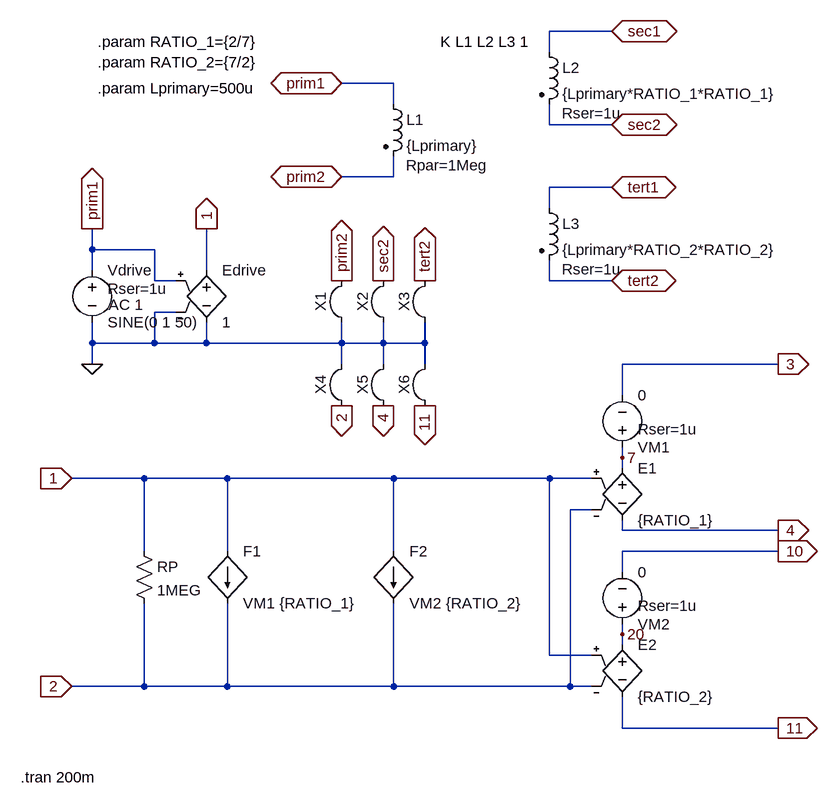
[diagram p0: schematic Transformers.asc]
Transformers.asc, the LTspice schematic file:
Version 4
SHEET 1 880 704
WIRE 384 -544 288 -544
WIRE 288 -512 288 -544
WIRE 48 -464 -32 -464
WIRE 48 -432 48 -464
WIRE 288 -400 288 -432
WIRE 384 -400 288 -400
WIRE 48 -320 48 -352
WIRE 48 -320 -32 -320
WIRE 384 -304 288 -304
WIRE 288 -272 288 -304
WIRE -416 -208 -416 -240
WIRE -320 -208 -416 -208
WIRE -416 -176 -416 -208
WIRE -240 -176 -240 -240
WIRE -320 -160 -320 -208
WIRE -288 -160 -320 -160
WIRE 288 -160 288 -192
WIRE 384 -160 288 -160
WIRE -288 -112 -320 -112
WIRE -416 -64 -416 -96
WIRE -320 -64 -320 -112
WIRE -320 -64 -416 -64
WIRE -240 -64 -240 -96
WIRE -240 -64 -320 -64
WIRE -32 -64 -32 -96
WIRE -32 -64 -240 -64
WIRE 32 -64 32 -96
WIRE 32 -64 -32 -64
WIRE 96 -64 96 -96
WIRE 96 -64 32 -64
WIRE -416 -32 -416 -64
WIRE -32 -32 -32 -64
WIRE 32 -32 32 -64
WIRE 96 -32 96 -64
WIRE 640 -32 400 -32
WIRE 400 16 400 -32
WIRE 400 112 400 96
WIRE 400 128 400 112
WIRE -336 144 -448 144
WIRE -208 144 -336 144
WIRE 48 144 -208 144
WIRE 288 144 48 144
WIRE 352 144 288 144
WIRE 352 192 320 192
WIRE 400 224 400 208
WIRE 640 224 400 224
WIRE -336 256 -336 144
WIRE -208 256 -208 144
WIRE 48 256 48 144
WIRE 640 256 400 256
WIRE 400 288 400 256
WIRE 400 384 400 368
WIRE 400 400 400 384
WIRE 288 416 288 144
WIRE 352 416 288 416
WIRE -336 464 -336 336
WIRE -336 464 -448 464
WIRE -208 464 -208 336
WIRE -208 464 -336 464
WIRE 48 464 48 336
WIRE 48 464 -208 464
WIRE 320 464 320 192
WIRE 320 464 48 464
WIRE 352 464 320 464
WIRE 400 528 400 480
WIRE 640 528 400 528
FLAG -448 144 1
IOPIN -448 144 In
FLAG -448 464 2
IOPIN -448 464 In
FLAG 400 112 7
FLAG 640 -32 3
IOPIN 640 -32 Out
FLAG 640 224 4
IOPIN 640 224 Out
FLAG 640 528 11
IOPIN 640 528 Out
FLAG 400 384 20
FLAG 640 256 10
IOPIN 640 256 Out
FLAG -32 -464 prim1
IOPIN -32 -464 BiDir
FLAG -32 -320 prim2
IOPIN -32 -320 BiDir
FLAG 384 -544 sec1
IOPIN 384 -544 BiDir
FLAG 384 -400 sec2
IOPIN 384 -400 BiDir
FLAG 384 -304 tert1
IOPIN 384 -304 BiDir
FLAG 384 -160 tert2
IOPIN 384 -160 BiDir
FLAG -416 -32 0
FLAG -416 -240 prim1
IOPIN -416 -240 Out
FLAG -240 -240 1
IOPIN -240 -240 Out
FLAG -32 -160 prim2
IOPIN -32 -160 Out
FLAG 32 -160 sec2
IOPIN 32 -160 Out
FLAG 96 -160 tert2
IOPIN 96 -160 Out
FLAG -32 32 2
IOPIN -32 32 Out
FLAG 32 32 4
IOPIN 32 32 Out
FLAG 96 32 11
IOPIN 96 32 Out
SYMBOL res -352 240 R0
SYMATTR InstName RP
SYMATTR Value 1MEG
SYMBOL e 400 112 R0
SYMATTR InstName E1
SYMATTR Value {RATIO_1}
SYMBOL f -208 256 R0
SYMATTR InstName F1
SYMATTR Value VM1 {RATIO_1}
SYMBOL e 400 384 R0
SYMATTR InstName E2
SYMATTR Value {RATIO_2}
SYMBOL f 48 256 R0
SYMATTR InstName F2
SYMATTR Value VM2 {RATIO_2}
SYMBOL voltage 400 112 M180
WINDOW 123 0 0 Left 0
WINDOW 39 24 44 Left 0
SYMATTR InstName VM1
SYMATTR Value 0
SYMATTR SpiceLine Rser=1u
SYMBOL voltage 400 384 M180
WINDOW 123 0 0 Left 0
WINDOW 39 24 44 Left 0
SYMATTR InstName VM2
SYMATTR Value 0
SYMATTR SpiceLine Rser=1u
SYMBOL ind2 32 -448 R0
WINDOW 39 35 110 Left 0
SYMATTR InstName L1
SYMATTR Value {Lprimary}
SYMATTR Type ind
SYMATTR SpiceLine Rpar=1Meg
SYMBOL ind2 272 -528 R0
WINDOW 39 35 110 Left 0
SYMATTR InstName L2
SYMATTR Value {Lprimary*RATIO_1*RATIO_1}
SYMATTR Type ind
SYMATTR SpiceLine Rser=1u
SYMBOL ind2 272 -288 R0
WINDOW 39 35 110 Left 0
SYMATTR InstName L3
SYMATTR Value {Lprimary*RATIO_2*RATIO_2}
SYMATTR Type ind
SYMATTR SpiceLine Rser=1u
SYMBOL voltage -416 -192 R0
WINDOW 123 25 69 Left 0
WINDOW 39 24 44 Left 0
SYMATTR InstName Vdrive
SYMATTR Value SINE(0 1 50)
SYMATTR Value2 AC 1
SYMATTR SpiceLine Rser=1u
SYMBOL e -240 -192 R0
SYMATTR InstName Edrive
SYMATTR Value 1
SYMBOL Misc\\jumper -96 -128 M90
SYMATTR InstName X1
SYMBOL Misc\\jumper -32 -128 M90
SYMATTR InstName X2
SYMBOL Misc\\jumper 32 -128 M90
SYMATTR InstName X3
SYMBOL Misc\\jumper -96 0 M90
SYMATTR InstName X4
SYMBOL Misc\\jumper -32 0 M90
SYMATTR InstName X5
SYMBOL Misc\\jumper 32 0 M90
SYMATTR InstName X6
TEXT 120 -528 Left 0 !K L1 L2 L3 1
TEXT -408 -528 Left 0 !.param RATIO_1={2/7}
TEXT -408 -496 Left 0 !.param RATIO_2={7/2}
TEXT -526 604 Left 0 !.tran 200m
TEXT -408 -456 Left 0 !.param Lprimary=500u

The netlist it stands for:
* Transformers.asc
RP 1 0 1MEG
E1 7 0 1 0 {RATIO_1}
F1 1 0 VM1 {RATIO_1}
E2 20 0 1 0 {RATIO_2}
F2 1 0 VM2 {RATIO_2}
VM1 7 3 0 Rser=1u
VM2 20 10 0 Rser=1u
L1 prim1 0 {Lprimary} Rpar=1Meg
L2 sec1 0 {Lprimary*RATIO_1*RATIO_1} Rser=1u
L3 tert1 0 {Lprimary*RATIO_2*RATIO_2} Rser=1u
Vdrive prim1 0 SINE(0 1 50) AC 1 Rser=1u
Edrive 1 0 prim1 0 1
K L1 L2 L3 1
.param RATIO_1={2/7}
.param RATIO_2={7/2}
.tran 200m
.param Lprimary=500u
.backanno
.end